# Altium schematic sheet temperture.SchDoc
size A3
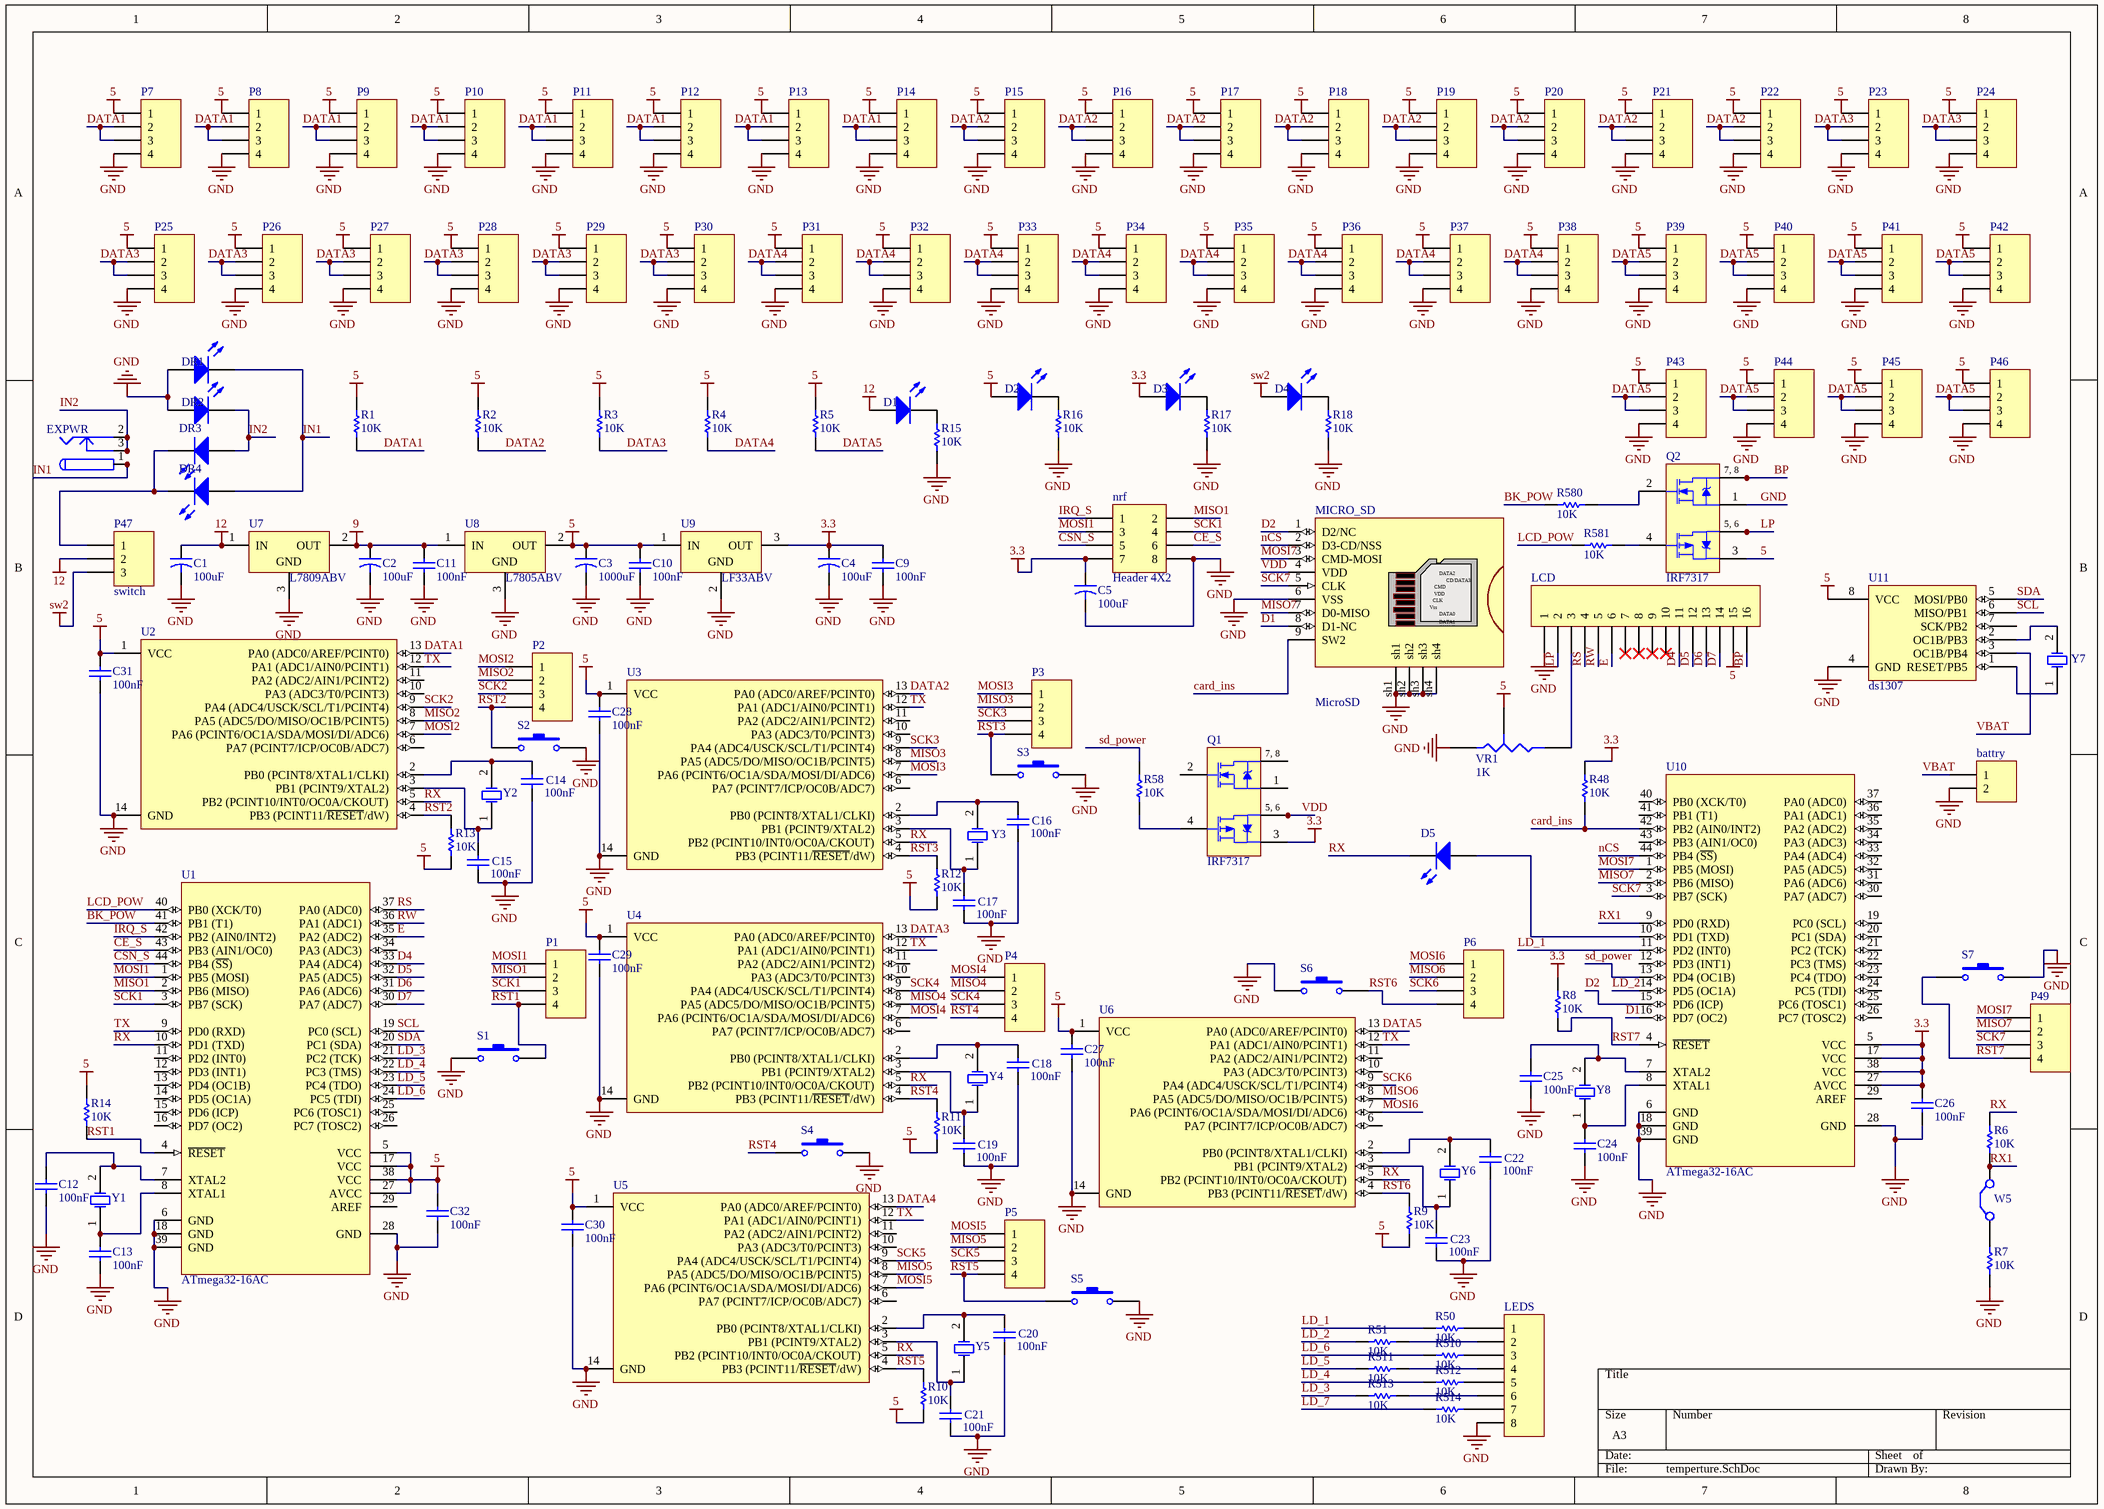
[diagram p0: temperture.SchDoc]

## Parts
battry  Header 2  [Battry]  (value not drawn)
C1  value 100uF  [cap]  (hidden comment: Cap2)
C2  value 100uF  [cap]  (hidden comment: Cap2)
C3  value 1000uF  [cap]  (hidden comment: Cap2)
C4  value 100uF  [cap]  (hidden comment: Cap2)
C5  value 100uF  [cap]  (hidden comment: Cap2)
C9  value 100nF  [H1X02F]  (hidden comment: Cap)
C10  value 100nF  [H1X02F]  (hidden comment: Cap)
C11  value 100nF  [H1X02F]  (hidden comment: Cap)
C12  value 100nF  [H1X02F]  (hidden comment: Cap)
C13  value 100nF  [H1X02F]  (hidden comment: Cap)
C14  value 100nF  [H1X02F]  (hidden comment: Cap)
C15  value 100nF  [H1X02F]  (hidden comment: Cap)
C16  value 100nF  [H1X02F]  (hidden comment: Cap)
C17  value 100nF  [H1X02F]  (hidden comment: Cap)
C18  value 100nF  [H1X02F]  (hidden comment: Cap)
C19  value 100nF  [H1X02F]  (hidden comment: Cap)
C20  value 100nF  [H1X02F]  (hidden comment: Cap)
C21  value 100nF  [H1X02F]  (hidden comment: Cap)
C22  value 100nF  [H1X02F]  (hidden comment: Cap)
C23  value 100nF  [H1X02F]  (hidden comment: Cap)
C24  value 100nF  [H1X02F]  (hidden comment: Cap)
C25  value 100nF  [H1X02F]  (hidden comment: Cap)
C26  value 100nF  [H1X02F]  (hidden comment: Cap)
C27  value 100nF  [H1X02F]  (hidden comment: Cap)
C28  value 100nF  [H1X02F]  (hidden comment: Cap)
C29  value 100nF  [H1X02F]  (hidden comment: Cap)
C30  value 100nF  [H1X02F]  (hidden comment: Cap)
C31  value 100nF  [H1X02F]  (hidden comment: Cap)
C32  value 100nF  [H1X02F]  (hidden comment: Cap)
D1  LED0  [LED5mm]  (value not drawn)
D2  LED0  [LED5mm]  (value not drawn)
D3  LED0  [LED5mm]  (value not drawn)
D4  LED0  [LED5mm]  (value not drawn)
D5  LED0  [AXIAL-0.4]  (value not drawn)
DR1  LED0  [AXIAL-0.3]  (value not drawn)
DR2  LED0  [AXIAL-0.3]  (value not drawn)
DR3  LED0  [AXIAL-0.3]  (value not drawn)
DR4  LED0  [AXIAL-0.3]  (value not drawn)
EXPWR  PWR2.5  [JACK1]  (value not drawn)
LCD  Header 16  [H1X16F]  (value not drawn)
LEDS  Header 8  [H1X08F]  (value not drawn)
MICRO_SD  MicroSD  [MicroSD_1]
nrf  Header 4X2  [HDR2X4]
P1  Header 4  [H1X04F]  (value not drawn)
P2  Header 4  [H1X04F]  (value not drawn)
P3  Header 4  [H1X04F]  (value not drawn)
P4  Header 4  [H1X04F]  (value not drawn)
P5  Header 4  [H1X04F]  (value not drawn)
P6  Header 4  [H1X04F]  (value not drawn)
P7  Header 4  [RJ11]  (value not drawn)
P8  Header 4  [RJ11]  (value not drawn)
P9  Header 4  [RJ11]  (value not drawn)
P10  Header 4  [RJ11]  (value not drawn)
P11  Header 4  [RJ11]  (value not drawn)
P12  Header 4  [RJ11]  (value not drawn)
P13  Header 4  [RJ11]  (value not drawn)
P14  Header 4  [RJ11]  (value not drawn)
P15  Header 4  [RJ11]  (value not drawn)
P16  Header 4  [RJ11]  (value not drawn)
P17  Header 4  [RJ11]  (value not drawn)
P18  Header 4  [RJ11]  (value not drawn)
P19  Header 4  [RJ11]  (value not drawn)
P20  Header 4  [RJ11]  (value not drawn)
P21  Header 4  [RJ11]  (value not drawn)
P22  Header 4  [RJ11]  (value not drawn)
P23  Header 4  [RJ11]  (value not drawn)
P24  Header 4  [RJ11]  (value not drawn)
P25  Header 4  [RJ11]  (value not drawn)
P26  Header 4  [RJ11]  (value not drawn)
P27  Header 4  [RJ11]  (value not drawn)
P28  Header 4  [RJ11]  (value not drawn)
P29  Header 4  [RJ11]  (value not drawn)
P30  Header 4  [RJ11]  (value not drawn)
P31  Header 4  [RJ11]  (value not drawn)
P32  Header 4  [RJ11]  (value not drawn)
P33  Header 4  [RJ11]  (value not drawn)
P34  Header 4  [RJ11]  (value not drawn)
P35  Header 4  [RJ11]  (value not drawn)
P36  Header 4  [RJ11]  (value not drawn)
P37  Header 4  [RJ11]  (value not drawn)
P38  Header 4  [RJ11]  (value not drawn)
P39  Header 4  [RJ11]  (value not drawn)
P40  Header 4  [RJ11]  (value not drawn)
P41  Header 4  [RJ11]  (value not drawn)
P42  Header 4  [RJ11]  (value not drawn)
P43  Header 4  [RJ11]  (value not drawn)
P44  Header 4  [RJ11]  (value not drawn)
P45  Header 4  [RJ11]  (value not drawn)
P46  Header 4  [RJ11]  (value not drawn)
P47  switch  [peymanswitch]
P49  Header 4  [H1X04F]  (value not drawn)
Q1  IRF7317  [SO-8_N]
Q2  IRF7317  [SO-8_N]
R1  value 10K  [AXIAL-0.3]  (hidden comment: Res1)
R2  value 10K  [AXIAL-0.3]  (hidden comment: Res1)
R3  value 10K  [AXIAL-0.3]  (hidden comment: Res1)
R4  value 10K  [AXIAL-0.3]  (hidden comment: Res1)
R5  value 10K  [AXIAL-0.3]  (hidden comment: Res1)
R6  value 10K  [AXIAL-0.3]  (hidden comment: Res1)
R7  value 10K  [AXIAL-0.3]  (hidden comment: Res1)
R8  value 10K  [AXIAL-0.3]  (hidden comment: Res1)
R9  value 10K  [AXIAL-0.3]  (hidden comment: Res1)
R10  value 10K  [AXIAL-0.3]  (hidden comment: Res1)
R11  value 10K  [AXIAL-0.3]  (hidden comment: Res1)
R12  value 10K  [AXIAL-0.3]  (hidden comment: Res1)
R13  value 10K  [AXIAL-0.3]  (hidden comment: Res1)
R14  value 10K  [AXIAL-0.3]  (hidden comment: Res1)
R15  value 10K  [AXIAL-0.3]  (hidden comment: Res1)
R16  value 10K  [AXIAL-0.3]  (hidden comment: Res1)
R17  value 10K  [AXIAL-0.3]  (hidden comment: Res1)
R18  value 10K  [AXIAL-0.3]  (hidden comment: Res1)
R48  value 10K  [AXIAL-0.3]  (hidden comment: Res1)
R50  value 10K  [AXIAL-0.3]  (hidden comment: Res1)
R51  value 10K  [AXIAL-0.3]  (hidden comment: Res1)
R58  value 10K  [AXIAL-0.3]  (hidden comment: Res1)
R510  value 10K  [SMD[1206]]  (hidden comment: Res1)
R511  value 10K  [SMD[1206]]  (hidden comment: Res1)
R512  value 10K  [SMD[1206]]  (hidden comment: Res1)
R513  value 10K  [SMD[1206]]  (hidden comment: Res1)
R514  value 10K  [SMD[1206]]  (hidden comment: Res1)
R580  value 10K  [AXIAL-0.3]  (hidden comment: Res1)
R581  value 10K  [AXIAL-0.3]  (hidden comment: Res1)
S1  SW-PB  [PB4]  (value not drawn)
S2  SW-PB  [PB4]  (value not drawn)
S3  SW-PB  [PB4]  (value not drawn)
S4  SW-PB  [PB4]  (value not drawn)
S5  SW-PB  [PB4]  (value not drawn)
S6  SW-PB  [PB4]  (value not drawn)
S7  SW-PB  [PB4]  (value not drawn)
U1  ATmega32-16AC  [TQFP44]
U2  ATtiny24V-10SSU  [SOIC14]  (value not drawn)
U3  ATtiny24V-10SSU  [SOIC14]  (value not drawn)
U4  ATtiny24V-10SSU  [SOIC14]  (value not drawn)
U5  ATtiny24V-10SSU  [SOIC14]  (value not drawn)
U6  ATtiny24V-10SSU  [SOIC14]  (value not drawn)
U7  L7809ABV  [TO220ABN]
U8  L7805ABV  [TO220ABN]
U9  LF33ABV  [TO-220A]
U10  ATmega32-16AC  [TQFP44]
U11  ds1307  [DIP8-1]
VR1  value 1K  [H1X03F]  (hidden comment: Res Tap)
W5  Jumper  [H1X02F]  (value not drawn)
Y1  XTAL  [CRYSTALL]  (value not drawn)
Y2  XTAL  [CRYSTALL]  (value not drawn)
Y3  XTAL  [CRYSTALL]  (value not drawn)
Y4  XTAL  [CRYSTALL]  (value not drawn)
Y5  XTAL  [CRYSTALL]  (value not drawn)
Y6  XTAL  [CRYSTALL]  (value not drawn)
Y7  XTAL  [H1X02F]  (value not drawn)
Y8  XTAL  [CRYSTALL]  (value not drawn)

## Nets
3.3: C4.1 C5.1 C9.1 C26.1 D3.1(A) nrf.7 Q1.3(S2) R8.1 R48.1 U9.3(OUT) U10.5(VCC) U10.17(VCC) U10.27(AVCC) U10.38(VCC)
5: C3.1 C10.1 C27.1 C28.1 C29.1 C30.1 C31.1 C32.1 D2.1(A) LCD.15 P7.1 P8.1 P9.1 P10.1 P11.1 P12.1 P13.1 P14.1 P15.1 P16.1 P17.1 P18.1 P19.1 P20.1 P21.1 P22.1 P23.1 P24.1 P25.1 P26.1 P27.1 P28.1 P29.1 P30.1 P31.1 P32.1 P33.1 P34.1 P35.1 P36.1 P37.1 P38.1 P39.1 P40.1 P41.1 P42.1 P43.1 P44.1 P45.1 P46.1 Q2.3(S2) R1.2 R2.2 R3.2 R4.2 R5.2 R9.2 R10.2 R11.2 R12.2 R13.2 R14.1 U1.5(VCC) U1.17(VCC) U1.27(AVCC) U1.38(VCC) U2.1(VCC) U3.1(VCC) U4.1(VCC) U5.1(VCC) U6.1(VCC) U8.2(OUT) U9.1(IN) U11.8(VCC) VR1.3(TAP)
9: C2.1 C11.1 U7.2(OUT) U8.1(IN)
12: C1.1 D1.1(A) P47.2 U7.1(IN)
GND: battry.2 C1.2 C2.2 C3.2 C4.2 C5.2 C9.2 C10.2 C11.2 C12.2 C13.2 C14.2 C15.2 C16.2 C17.2 C18.2 C19.2 C20.2 C21.2 C22.2 C23.2 C24.2 C25.2 C26.2 C27.2 C28.2 C29.2 C30.2 C31.2 C32.2 DR1.1(A) DR2.1(A) LCD.1 LEDS.8 MICRO_SD.6(VSS) MICRO_SD.sh1 MICRO_SD.sh2 MICRO_SD.sh3 MICRO_SD.sh4 nrf.8 P7.4 P8.4 P9.4 P10.4 P11.4 P12.4 P13.4 P14.4 P15.4 P16.4 P17.4 P18.4 P19.4 P20.4 P21.4 P22.4 P23.4 P24.4 P25.4 P26.4 P27.4 P28.4 P29.4 P30.4 P31.4 P32.4 P33.4 P34.4 P35.4 P36.4 P37.4 P38.4 P39.4 P40.4 P41.4 P42.4 P43.4 P44.4 P45.4 P46.4 Q2.1(S1) R7.2 R15.1 R16.1 R17.1 R18.1 S1.1 S2.2 S3.2 S4.2 S5.2 S6.1 S7.2 U1.6(GND) U1.18(GND) U1.28(GND) U1.39(GND) U2.14(GND) U3.14(GND) U4.14(GND) U5.14(GND) U6.14(GND) U7.3(GND) U8.3(GND) U9.2(GND) U10.6(GND) U10.18(GND) U10.28(GND) U10.39(GND) U11.4(GND) VR1.1(A)
SW1: MICRO_SD.10(SW1)
sw2: D4.1(A) P47.3
BK_POW: R580.1 U1.41(PB1_(T1))
BP: LCD.16 Q2.7(D1) Q2.8(D1)
card_ins: MICRO_SD.9(SW2) R48.2 U10.42(PB2_(AIN0/INT2))
CE_S: nrf.6 U1.43(PB3_(AIN1/OC0))
CSN_S: nrf.5 U1.44(PB4_(~{SS}))
D1: MICRO_SD.8(D1-NC) U10.16(PD7_(OC2))
D2: MICRO_SD.1(D2/NC) U10.15(PD6_(ICP))
D4: LCD.11 U1.33(PA4_(ADC4))
D5: LCD.12 U1.32(PA5_(ADC5))
D6: LCD.13 U1.31(PA6_(ADC6))
D7: LCD.14 U1.30(PA7_(ADC7))
DATA1: P7.2 P7.3 P8.2 P8.3 P9.2 P9.3 P10.2 P10.3 P11.2 P11.3 P12.2 P12.3 P13.2 P13.3 P14.2 P14.3 R1.1 U2.13(PA0_(ADC0/AREF/PCINT0))
DATA2: P15.2 P15.3 P16.2 P16.3 P17.2 P17.3 P18.2 P18.3 P19.2 P19.3 P20.2 P20.3 P21.2 P21.3 P22.2 P22.3 R2.1 U3.13(PA0_(ADC0/AREF/PCINT0))
DATA3: P23.2 P23.3 P24.2 P24.3 P25.2 P25.3 P26.2 P26.3 P27.2 P27.3 P28.2 P28.3 P29.2 P29.3 P30.2 P30.3 R3.1 U4.13(PA0_(ADC0/AREF/PCINT0))
DATA4: P31.2 P31.3 P32.2 P32.3 P33.2 P33.3 P34.2 P34.3 P35.2 P35.3 P36.2 P36.3 P37.2 P37.3 P38.2 P38.3 R4.1 U5.13(PA0_(ADC0/AREF/PCINT0))
DATA5: P39.2 P39.3 P40.2 P40.3 P41.2 P41.3 P42.2 P42.3 P43.2 P43.3 P44.2 P44.3 P45.2 P45.3 P46.2 P46.3 R5.1 U6.13(PA0_(ADC0/AREF/PCINT0))
E: LCD.6 U1.35(PA2_(ADC2))
IN1: DR1.2(K) DR4.1(A) EXPWR.1 EXPWR.1A EXPWR.1B
IN2: DR2.2(K) DR3.1(A) EXPWR.2 EXPWR.2A EXPWR.2B EXPWR.3 EXPWR.3A EXPWR.3B
IRQ_S: nrf.1 U1.42(PB2_(AIN0/INT2))
LCD_POW: R581.1 U1.40(PB0_(XCK/T0))
LD_1: R50.1 U10.11(PD2_(INT0))
LD_2: R51.1 U10.14(PD5_(OC1A))
LD_3: R513.1 U1.21(PC2_(TCK))
LD_4: R512.1 U1.22(PC3_(TMS))
LD_5: R511.1 U1.23(PC4_(TDO))
LD_6: R510.1 U1.24(PC5_(TDI))
LD_7: R514.1
LP: LCD.2 Q2.5(D2) Q2.6(D2)
MISO1: nrf.2 P1.2 U1.2(PB6_(MISO))
MISO2: P2.2 U2.8(PA5_(ADC5/DO/MISO/OC1B/PCINT5))
MISO3: P3.2 U3.8(PA5_(ADC5/DO/MISO/OC1B/PCINT5))
MISO4: P4.2 U4.8(PA5_(ADC5/DO/MISO/OC1B/PCINT5))
MISO5: P5.2 U5.8(PA5_(ADC5/DO/MISO/OC1B/PCINT5))
MISO6: P6.2 U6.8(PA5_(ADC5/DO/MISO/OC1B/PCINT5))
MISO7: MICRO_SD.7(D0-MISO) P49.2 U10.2(PB6_(MISO))
MOSI1: nrf.3 P1.1 U1.1(PB5_(MOSI))
MOSI2: P2.1 U2.7(PA6_(PCINT6/OC1A/SDA/MOSI/DI/ADC6))
MOSI3: P3.1 U3.7(PA6_(PCINT6/OC1A/SDA/MOSI/DI/ADC6))
MOSI4: P4.1 U4.7(PA6_(PCINT6/OC1A/SDA/MOSI/DI/ADC6))
MOSI5: P5.1 U5.7(PA6_(PCINT6/OC1A/SDA/MOSI/DI/ADC6))
MOSI6: P6.1 U6.7(PA6_(PCINT6/OC1A/SDA/MOSI/DI/ADC6))
MOSI7: MICRO_SD.3(CMD-MOSI) P49.1 U10.1(PB5_(MOSI))
nCS: MICRO_SD.2(D3-CD/NSS) U10.44(PB4_(~{SS}))
RS: LCD.4 U1.37(PA0_(ADC0))
RST1: P1.4 R14.2 S1.2 U1.4(~{RESET})
RST2: P2.4 R13.1 S2.1 U2.4(PB3_(PCINT11/~{RESET}/dW))
RST3: P3.4 R12.1 S3.1 U3.4(PB3_(PCINT11/~{RESET}/dW))
RST4: P4.4 R11.1 S4.1 U4.4(PB3_(PCINT11/~{RESET}/dW))
RST5: P5.4 R10.1 S5.1 U5.4(PB3_(PCINT11/~{RESET}/dW))
RST6: P6.4 R9.1 S6.2 U6.4(PB3_(PCINT11/~{RESET}/dW))
RST7: P49.4 R8.2 S7.1 U10.4(~{RESET})
RW: LCD.5 U1.36(PA1_(ADC1))
RX: D5.2(K) R6.1 U1.10(PD1_(TXD)) U2.5(PB2_(PCINT10/INT0/OC0A/CKOUT)) U3.5(PB2_(PCINT10/INT0/OC0A/CKOUT)) U4.5(PB2_(PCINT10/INT0/OC0A/CKOUT)) U5.5(PB2_(PCINT10/INT0/OC0A/CKOUT)) U6.5(PB2_(PCINT10/INT0/OC0A/CKOUT))
RX1: R6.2 U10.9(PD0_(RXD)) W5.2(C2)
SCK1: nrf.4 P1.3 U1.3(PB7_(SCK))
SCK2: P2.3 U2.9(PA4_(ADC4/USCK/SCL/T1/PCINT4))
SCK3: P3.3 U3.9(PA4_(ADC4/USCK/SCL/T1/PCINT4))
SCK4: P4.3 U4.9(PA4_(ADC4/USCK/SCL/T1/PCINT4))
SCK5: P5.3 U5.9(PA4_(ADC4/USCK/SCL/T1/PCINT4))
SCK6: P6.3 U6.9(PA4_(ADC4/USCK/SCL/T1/PCINT4))
SCK7: MICRO_SD.5(CLK) P49.3 U10.3(PB7_(SCK))
SCL: U1.19(PC0_(SCL)) U11.6(MISO/PB1)
sd_power: R58.1 U10.13(PD4_(OC1B))
SDA: U1.20(PC1_(SDA)) U11.5(MOSI/PB0)
TX: U1.9(PD0_(RXD)) U2.12(PA1_(ADC1/AIN0/PCINT1)) U3.12(PA1_(ADC1/AIN0/PCINT1)) U4.12(PA1_(ADC1/AIN0/PCINT1)) U5.12(PA1_(ADC1/AIN0/PCINT1)) U6.12(PA1_(ADC1/AIN0/PCINT1))
VBAT: battry.1 U11.3(OC1B/PB4)
VDD: MICRO_SD.4(VDD) Q1.5(D2) Q1.6(D2)
NetC12_1: C12.1 U1.7(XTAL2) Y1.2(OSC2)
NetC13_1: C13.1 U1.8(XTAL1) Y1.1(OSC1)
NetC14_1: C14.1 U2.2(PB0_(PCINT8/XTAL1/CLKI)) Y2.2(OSC2)
NetC15_1: C15.1 U2.3(PB1_(PCINT9/XTAL2)) Y2.1(OSC1)
NetC16_1: C16.1 U3.2(PB0_(PCINT8/XTAL1/CLKI)) Y3.2(OSC2)
NetC17_1: C17.1 U3.3(PB1_(PCINT9/XTAL2)) Y3.1(OSC1)
NetC18_1: C18.1 U4.2(PB0_(PCINT8/XTAL1/CLKI)) Y4.2(OSC2)
NetC19_1: C19.1 U4.3(PB1_(PCINT9/XTAL2)) Y4.1(OSC1)
NetC20_1: C20.1 U5.2(PB0_(PCINT8/XTAL1/CLKI)) Y5.2(OSC2)
NetC21_1: C21.1 U5.3(PB1_(PCINT9/XTAL2)) Y5.1(OSC1)
NetC22_1: C22.1 U6.2(PB0_(PCINT8/XTAL1/CLKI)) Y6.2(OSC2)
NetC23_1: C23.1 U6.3(PB1_(PCINT9/XTAL2)) Y6.1(OSC1)
NetC24_1: C24.1 U10.8(XTAL1) Y8.1(OSC1)
NetC25_1: C25.1 U10.7(XTAL2) Y8.2(OSC2)
NetD1_2: D1.2(K) R15.2
NetD2_2: D2.2(K) R16.2
NetD3_2: D3.2(K) R17.2
NetD4_2: D4.2(K) R18.2
NetD5_1: D5.1(A) U10.10(PD1_(TXD))
NetDR3_2: DR3.2(K) DR4.2(K) P47.1
NetLCD_3: LCD.3 VR1.2(B)
NetLEDS_1: LEDS.1 R50.2
NetLEDS_2: LEDS.2 R51.2
NetLEDS_3: LEDS.3 R510.2
NetLEDS_4: LEDS.4 R511.2
NetLEDS_5: LEDS.5 R512.2
NetLEDS_6: LEDS.6 R513.2
NetLEDS_7: LEDS.7 R514.2
NetQ1_4: Q1.4(G2) R58.2
NetQ1_7: Q1.7(D1) Q1.8(D1)
NetQ2_2: Q2.2(G1) R580.2
NetQ2_4: Q2.4(G2) R581.2
NetR7_1: R7.1 W5.1(C1)
NetU11_1: U11.1(RESET/PB5) Y7.1(OSC1)
NetU11_2: U11.2(OC1B/PB3) Y7.2(OSC2)

Not connected (* = marked no-connect by the designer): LCD 7* 8* 9* 10*; Q1 1(S1) 2(G1); U1 11(PD2_(INT0)) 12(PD3_(INT1)) 13(PD4_(OC1B)) 14(PD5_(OC1A)) 15(PD6_(ICP)) 16(PD7_(OC2)) 25(PC6_(TOSC1)) 26(PC7_(TOSC2)) 29(AREF) 34(PA3_(ADC3)); U2 6(PA7_(PCINT7/ICP/OC0B/ADC7)) 10(PA3_(ADC3/T0/PCINT3)) 11(PA2_(ADC2/AIN1/PCINT2)); U3 6(PA7_(PCINT7/ICP/OC0B/ADC7)) 10(PA3_(ADC3/T0/PCINT3)) 11(PA2_(ADC2/AIN1/PCINT2)); U4 6(PA7_(PCINT7/ICP/OC0B/ADC7)) 10(PA3_(ADC3/T0/PCINT3)) 11(PA2_(ADC2/AIN1/PCINT2)); U5 6(PA7_(PCINT7/ICP/OC0B/ADC7)) 10(PA3_(ADC3/T0/PCINT3)) 11(PA2_(ADC2/AIN1/PCINT2)); U6 6(PA7_(PCINT7/ICP/OC0B/ADC7)) 10(PA3_(ADC3/T0/PCINT3)) 11(PA2_(ADC2/AIN1/PCINT2)); U10 12(PD3_(INT1)) 19(PC0_(SCL)) 20(PC1_(SDA)) 21(PC2_(TCK)) 22(PC3_(TMS)) 23(PC4_(TDO)) 24(PC5_(TDI)) 25(PC6_(TOSC1)) 26(PC7_(TOSC2)) 29(AREF) 30(PA7_(ADC7)) 31(PA6_(ADC6)) 32(PA5_(ADC5)) 33(PA4_(ADC4)) 34(PA3_(ADC3)) 35(PA2_(ADC2)) 36(PA1_(ADC1)) 37(PA0_(ADC0)) 40(PB0_(XCK/T0)) 41(PB1_(T1)) 43(PB3_(AIN1/OC0)); U11 7(SCK/PB2)

## Notes on the sheet
- (in symbol IRF7317) 7, 8; 5, 6
- (in symbol MicroSD) DATA2; CD/DATA3; CMD; Vss; DATA0; DATA1

## Library data of the parts
battry = Header 2: Header, 2-Pin; LatestRevisionDate: 17-Jul-2002; LatestRevisionNote: Re-released for DXP Platform.; Publisher: Altium Limited
C1-C5 = Cap2: Capacitor; Published: 23-Sep-2002; PackageReference: CAPR5-4X5; Publisher: Altium Limited
C9-C32 = Cap: Capacitor; Published: 8-Jun-2000; LatestRevisionDate: 17-Jul-2002; LatestRevisionNote: Re-released for DXP Platform.; PackageReference: RAD-0.3; Publisher: Altium Limited
D1-D5 DR1-DR4 = LED0: Typical INFRARED GaAs LED; Published: 8-Jun-2000; LatestRevisionDate: 08-Jul-2005; LatestRevisionNote: Mech Layer 1 removed.; PackageReference: LED-0; Publisher: Altium Limited
EXPWR = PWR2.5: Low Voltage Power Supply Connector; Published: 17-Dec-2003; DatasheetDocument: 09-May-2002; Publisher: Altium Limited; ComponentLink1Description: Manufacturer Link; ComponentLink1URL: http://domino.kycon.com/internet/Products.html
LCD = Header 16: Header, 16-Pin; LatestRevisionDate: 17-Jul-2002; LatestRevisionNote: Re-released for DXP Platform.; Publisher: Altium Limited
LEDS = Header 8: Header, 8-Pin; LatestRevisionDate: 17-Jul-2002; LatestRevisionNote: Re-released for DXP Platform.; Publisher: Altium Limited
MICRO_SD = MicroSD: MicroSD_altium designer (M.Hariri); Created by:: *; VALUE: *
nrf = Header 4X2: Header, 4-Pin, Dual row; LatestRevisionDate: 17-Jul-2002; LatestRevisionNote: Re-released for DXP Platform.; Publisher: Altium Limited
P1-P46 P49 = Header 4: Header, 4-Pin; LatestRevisionDate: 17-Jul-2002; LatestRevisionNote: Re-released for DXP Platform.; Publisher: Altium Limited
P47 = Header 3: Header, 3-Pin; LatestRevisionDate: 17-Jul-2002; LatestRevisionNote: Re-released for DXP Platform.; Publisher: Altium Limited
Q1 Q2 = IRF7317: HEXFET Power MOSFET; Published: 8-Jun-2000; LatestRevisionDate: 13-Apr-2006; LatestRevisionNote: IPC-7351 Footprint Added.; DatasheetVersion: Dec-1997; PackageVersion: Feb-2001; PackageReference: SO-8; Publisher: Altium Limited; PackageDescription: 8-Pin Plastic Small Outline Integrated Circuit 1.27 mm Pitch; Code_JEDEC: MS-012-AA; Code_IPC: SOIC127P600-8; ComponentLink1Description: Manufacturer Link; ComponentLink1URL: http://www.irf.com/; ComponentLink2Description: Datasheet; ComponentLink2URL: http://www.irf.com/product-info/datasheets/data/IRFN140.pdf
R1-R18 R48 R50 R51 R58 R510-R514 R580 R581 = Res1: Resistor; Published: 8-Jun-2000; LatestRevisionDate: 17-Jul-2002; LatestRevisionNote: Re-released for DXP Platform.; PackageReference: AXIAL-0.3; Publisher: Altium Limited
S1-S7 = SW-PB: Switch; Published: 24-Mar-1999; LatestRevisionDate: 17-Jul-2002; LatestRevisionNote: Re-released for DXP Platform.; PackageReference: SPST-2; Publisher: Altium Limited
U1 U10 = ATmega32-16AC: 8-Bit AVR Microcontroller with 32K Bytes of In-System Programmable Flash Memory; Published: 17-Sep-2003; LatestRevisionDate: 13-Apr-2006; LatestRevisionNote: IPC-7351 Footprint Added.; DatasheetVersion: 2503C-AVR-10/02; PackageVersion: rev.B, Oct-2001; PackageReference: 44A; Publisher: Altium Limited; PackageDescription: 44-Pin Thin Quad Flat Pack 0.8 mm Pitch; ComponentLink1Description: Manufacturer Link; ComponentLink1URL: http://www.atmel.com; ComponentLink2Description: Datasheet; ComponentLink2URL: http://www.atmel.com/dyn/resources/prod_documents/doc2503.pdf
U2-U6 = ATtiny24V-10SSU: 8-bit AVR Microcontroller, 1.8-5.5V, 2KB Flash, 128 Bytes EEPROM, 128 Bytes SRAM, 14-pin SOIC, Industrial Grade (-40°C to 85°C), Pb-Free; ComponentAvailability: Not recommended for new design.; Published: 1-Apr-2010; DatasheetVersion: revH, Oct-2009; PackageVersion: revA, Feb-2002; PackageReference: 14S1; Publisher: Altium Limited; PackageDescription: 14-Lead, 0.150” Wide Body, Plastic Gull Wing Small Outline Package (SOIC); Supplier 1: Digi-Key; Supplier Part Number 1: ATTINY24V-10SSU-ND; Supplier 2: Farnell; Supplier Part Number 2: 1455141; Supplier 3: Mouser; Supplier Part Number 3: 556-ATTINY24V10SSU; Code_JEDEC: MS-012-AB; Code_IPC: SOIC127P600-14; ComponentLink1Description: Manufacturer Link; ComponentLink1URL: http://www.atmel.com/products/avr/default.asp?; ComponentLink2Description: ATtiny24/44/84 Datasheet; ComponentLink2URL: http://www.atmel.com/dyn/resources/prod_documents/doc8006.pdf; ComponentLink3Description: ATtiny24/44/84 Summary; ComponentLink3URL: http://www.atmel.com/dyn/resources/prod_documents/8006S.pdf; ComponentLink4Description: Atmel.com Home; ComponentLink4URL: http://www.atmel.com
U7 = L7809ABV: Precision 1A Regulator; Published: 24-Aug-2001; LatestRevisionDate: 17-Jul-2002; LatestRevisionNote: Re-released for DXP Platform.; DatasheetVersion: Nov-1999; PackageVersion: Jun-1998; PackageReference: TO220ABN; Publisher: Altium Limited; PackageDescription: TO, Thru-Hole, Vertical, Heatsink Mounted; 3 In-Line Leads; Pitch 2.54 mm; Pin sequence 1, 3, 2; ComponentLink1Description: Manufacturer Link; ComponentLink1URL: http://www.st.com/; ComponentLink2Description: Datasheet; ComponentLink2URL: http://www.st.com/stonline/products/literature/ds/2144/l7805ab.pdf
U8 = L7805ABV: Precision 1A Regulator; Note: Tab is connected to pin 3 (GND).; Published: 24-Aug-2001; LatestRevisionDate: 17-Jul-2002; LatestRevisionNote: Re-released for DXP Platform.; DatasheetVersion: Nov-1999; PackageVersion: Jun-1998; PackageReference: TO220ABN; Publisher: Altium Limited; PackageDescription: TO, Thru-Hole, Vertical, Heatsink Mounted; 3 In-Line Leads; Pitch 2.54 mm; Pin sequence 1, 3, 2; ComponentLink1Description: Manufacturer Link; ComponentLink1URL: http://www.st.com/; ComponentLink2Description: Datasheet; ComponentLink2URL: http://www.st.com/stonline/products/literature/ds/2144/l7805ab.pdf
U9 = LF33ABV: 500mA, Very Low Drop (0.45V) Voltage Regulator; Published: 24-Aug-2001; LatestRevisionDate: 06-Jun-2005; LatestRevisionNote: PCB Pin sequence re-ordered.; DatasheetVersion: Feb-2004; PackageVersion: Jul-2004; PackageReference: TO-220A; Publisher: Altium Limited; PackageDescription: TO, Thru-Hole, Vertical, Heatsink Mounted; 3 In-Line Leads; Pitch 2.54 mm; ComponentLink1Description: Manufacturer Link; ComponentLink1URL: http://www.st.com/; ComponentLink2Description: Datasheet; ComponentLink2URL: http://www.st.com/stonline/books/pdf/docs/2574.pdf
U11 = Attiny85: Attiny45
VR1 = Res Tap: Tapped Resistor; Sim Note: Enter the Resistance value and the set point into parameter fields.; Set Position: 0.5; Published: 24-Mar-1999; LatestRevisionDate: 17-Jul-2002; LatestRevisionNote: Re-released for DXP Platform.; PackageReference: VR3; Publisher: Altium Limited
W5 = Jumper: Jumper Wire; Published: 24-Mar-1999; LatestRevisionDate: 17-Jul-2002; LatestRevisionNote: Re-released for DXP Platform.; PackageReference: RAD-0.2; Publisher: Altium Limited
Y1-Y8 = XTAL: Crystal Oscillator; Published: 8-Jun-2000; LatestRevisionDate: 17-Jul-2002; LatestRevisionNote: Re-released for DXP Platform.; PackageReference: R38; Publisher: Altium Limited